# Altium schematic sheet Audio_Output_XLR2.SchDoc: Audio Out: Mini XLR 2
size 279 x 215 mm; DrawnBy: Connor Dack; Engineer: Connor Dack; DocumentNumber: 20; Revision: 1.0; SheetNumber: 20; SheetTotal: 20
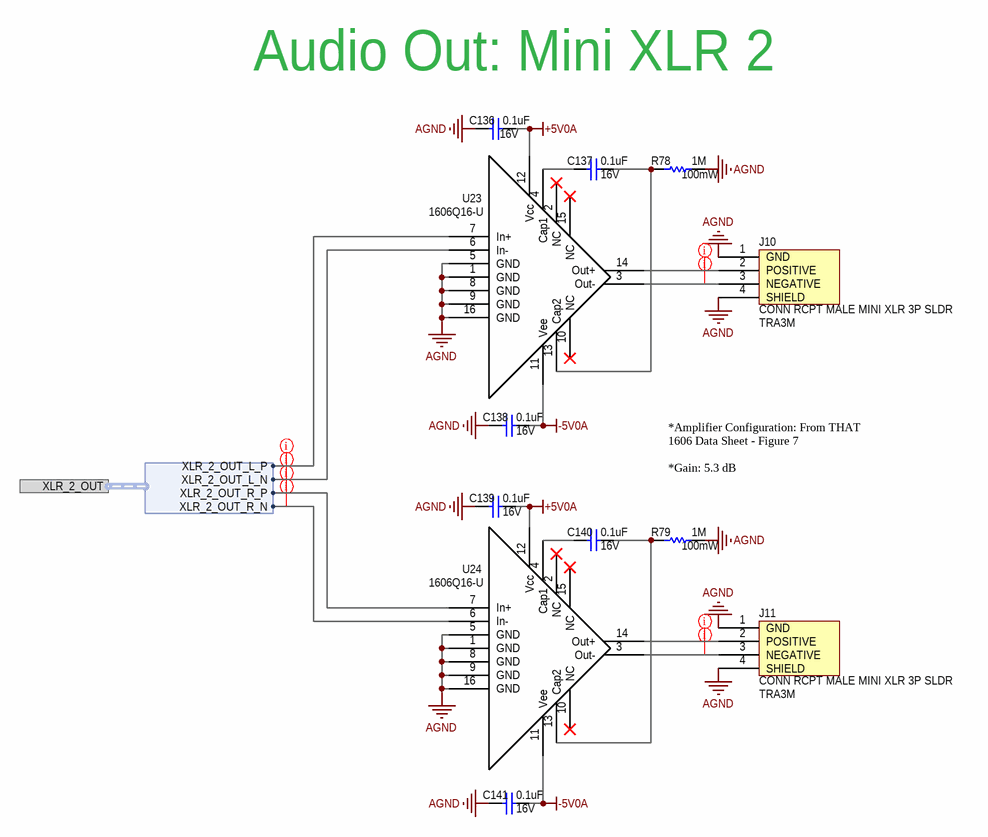
[diagram p0: Audio_Output_XLR2.SchDoc]

## Parts
C136  Voltage Rating: 16V  Capacitance: 0.1uF  [3-0603_L]  (hidden comment: CL10F104ZO8NNNC)
C137  Voltage Rating: 16V  Capacitance: 0.1uF  [3-0603_L]  (hidden comment: CL10F104ZO8NNNC)
C138  Voltage Rating: 16V  Capacitance: 0.1uF  [3-0603_L]  (hidden comment: CL10F104ZO8NNNC)
C139  Voltage Rating: 16V  Capacitance: 0.1uF  [3-0603_L]  (hidden comment: CL10F104ZO8NNNC)
C140  Voltage Rating: 16V  Capacitance: 0.1uF  [3-0603_L]  (hidden comment: CL10F104ZO8NNNC)
C141  Voltage Rating: 16V  Capacitance: 0.1uF  [3-0603_L]  (hidden comment: CL10F104ZO8NNNC)
J10  CONN RCPT MALE MINI XLR 3P SLDR  [TRA3M]
J11  CONN RCPT MALE MINI XLR 3P SLDR  [TRA3M]
R78  Max Power Dissipation: 100mW  Resistance: 1M  [3-0603_R_L]  (hidden comment: RMCF0603FG1M00)
R79  Max Power Dissipation: 100mW  Resistance: 1M  [3-0603_R_L]  (hidden comment: RMCF0603FG1M00)
U23  1606Q16-U  [SOP64P600X175-16N]
U24  1606Q16-U  [SOP64P600X175-16N]

## Ports
XLR_2_OUT (harness XLR_2_OUT)

## Harnesses
XLR_2_OUT: XLR_2_OUT_L_N, XLR_2_OUT_L_P, XLR_2_OUT_R_N, XLR_2_OUT_R_P

## Nets
+5V0A: C136.1 C139.1 U23.12(Vcc) U24.12(Vcc)
-5V0A: C138.1 C141.1 U23.11(Vee) U24.11(Vee)
AGND: C136.2 C138.2 C139.2 C141.2 J10.1(GND) J10.4(SHIELD) J11.1(GND) J11.4(SHIELD) R78.2 R79.2 U23.1(GND) U23.5(GND) U23.8(GND) U23.9(GND) U23.16(GND) U24.1(GND) U24.5(GND) U24.8(GND) U24.9(GND) U24.16(GND)
NetC137_1: C137.1 R78.1 U23.13(Cap2)
NetC137_2: C137.2 U23.4(Cap1)
NetC140_1: C140.1 R79.1 U24.13(Cap2)
NetC140_2: C140.2 U24.4(Cap1)
NetJ10_2: J10.2(POSITIVE) U23.14(Out+)
NetJ10_3: J10.3(NEGATIVE) U23.3(Out-)
NetJ11_2: J11.2(POSITIVE) U24.14(Out+)
NetJ11_3: J11.3(NEGATIVE) U24.3(Out-)
NetU23_6: U23.6(In-) ; port XLR_2_OUT.XLR_2_OUT_L_N
NetU23_7: U23.7(In+) ; port XLR_2_OUT.XLR_2_OUT_L_P
NetU24_6: U24.6(In-) ; port XLR_2_OUT.XLR_2_OUT_R_N
NetU24_7: U24.7(In+) ; port XLR_2_OUT.XLR_2_OUT_R_P

Not connected (* = marked no-connect by the designer): U23 2(NC)* 10(NC)* 15(NC)*; U24 2(NC)* 10(NC)* 15(NC)*

## Layout directives
net class XLR_2_Out: NetU23_6, NetU23_7, NetU24_6, NetU24_7
net class XLR_2_Out_Conn: NetJ10_2, NetJ10_3, NetJ11_2, NetJ11_3

## Notes on the sheet
- (near C136) Audio Out: Mini XLR 2
- *Amplifier Configuration: From THAT 1606 Data Sheet - Figure 7
  *Gain: 5.3 dB
- Title:
- Sheet:
- of
- Size:
- 11 x 8.5 Inches
- Rev:
- Date:
- Engineer:
- Time:
- File:
- Copyright 2020 Audio Logic Inc
  THE HARDWARE IS PROVIDED "AS IS", WITHOUT WARRANTY OF ANY KIND, EXPRESS OR IMPLIED, INCLUDING BUT NOT LIMITED TO THE WARRANTIES OF MERCHANTABILITY, FITNESS FOR A PARTICULAR PURPOSE AND NONINFRINGEMENT. IN NO EVENT SHALL THE AUTHORS OR COPYRIGHT HOLDERS BE LIABLE FOR ANY CLAIM, DAMAGES OR OTHER LIABILITY, WHETHER IN AN ACTION OF CONTRACT, TORT OR OTHERWISE, ARISING FROM, OUT OF OR IN CONNECTION WITH THE HARDWARE OR THE USE OR OTHER DEALINGS IN THE HARDWARE.

## Library data of the parts
C136-C141 = CL10F104ZO8NNNC: CAP CER 0.1UF 16V Y5V 0603; Manufacturer: Samsung; Tolerance: 80%; Supplier 1: Digi-Key; Stock 1: 40000; Pricing 1: 1=0.1, 10=0.038, 100=0.0169, 500=0.01208, 1000=0.00949 (USD); Mount: Surface Mount; Case/Package: 0603; Case Code (Metric): 1608; Case Code (Imperial): 0603; Min Operating Temperature: -30°C; Max Operating Temperature: 85°C; Package Quantity: 1; Packaging: Tape and Reel; Dielectric: Y5V; Length: 1.6mm; Height: 0.8mm; Width: 0.031inch; Thickness: 0.035inch; Depth: 0.8mm; Radiation Hardening: No; ComponentLink1URL: https://datasheet.ciiva.com/25805/cl10f104zo8nnnc-25805810.pdf; ComponentLink1Description: https://datasheet.ciiva.com/25805/cl10f104zo8nnnc-25805810.pdf; ComponentLink2URL: https://datasheet.ciiva.com/16199/cl10f104zo8nnnc-16199254.pdf; ComponentLink2Description: https://datasheet.ciiva.com/16199/cl10f104zo8nnnc-16199254.pdf; Supplier Part Number 1: 1276-1258-6-ND; Manufacturer Part Number: CL10F104ZO8NNNC
J10 J11 = TRA3M: 3 Position Circular Connector Receptacle, Male Pins Solder Silver; Manufacturer: Switchcraft; Body Material: Metal,Copper Alloy; Max Current Rating: 5A; Max Voltage Rating (AC): 125V; Voltage Rating: 250V; Connector Type: Receptacle,Pin; Number of Positions: 3; Number of Ports: 1; Wire/Cable Gauge: 28AWG; Supplier 1: Digi-Key; Stock 1: 295; Pricing 1: 1=12.74, 10=9.754, 25=9.5096, 50=8.7782, 100=8.2906, 250=7.9248 (USD); Mount: Through Hole,Panel,Bulkhead,PCB; Case/Package: Metal; Contact Material: Brass,Copper Alloy; Contact Plating: Nickel,Tin,Silver; Colour: Black; Number of Terminals: 3; Housing Material: Copper Alloy; Insulation Material: Thermoplastic; Min Operating Temperature: -55°C; Max Operating Temperature: 85°C; Package Quantity: 1; Current Rating: 5A; Fastening Type: Threaded; Packaging: Bulk; Gender: Male; Termination: Solder; Number of Contacts: 3; Orientation: Right Angle; Length: 15.49mm; Height: 15.24mm; Depth: 26.92mm; REACH SVHC: No SVHC; Lead Free: Lead Free; ComponentLink1URL: https://datasheet.ciiva.com/7327/tra3m-series-cd-7327368.pdf; ComponentLink1Description: https://datasheet.ciiva.com/7327/tra3m-series-cd-7327368.pdf; ComponentLink2URL: https://datasheet.ciiva.com/16879/70214235-16879259.pdf; ComponentLink2Description: https://datasheet.ciiva.com/16879/70214235-16879259.pdf; ComponentLink3URL: https://datasheet.ciiva.com/8053/28686-8053836.pdf; ComponentLink3Description: https://datasheet.ciiva.com/8053/28686-8053836.pdf; Supplier Part Number 1: SC1550-ND; Manufacturer Part Number: TRA3M
R78 R79 = RMCF0603FG1M00: RES 1M OHM 1% 1/10W 0603; Manufacturer: Stackpole Electronics; Temperature Coefficient: 100ppm/°C; Supplier 1: Digi-Key; Manufacturer Part Number: RMCF0603FG1M00; Stock 1: 129722; Pricing 1: 1=0.1, 10=0.017, 100=0.0069, 1000=0.00309, 2500=0.00268, 5000=0.00222 (USD); Mount: Surface Mount; Case/Package: 0603; Case Code (Metric): 1608; Case Code (Imperial): 0603; Contact Plating: Tin,Matte; Min Operating Temperature: -55°C; Max Operating Temperature: 155°C; Package Quantity: 1; Packaging: Tape and Reel; Tolerance: 1%; Composition: Thick Film; Number of Terminations: 2; Length: 0.061inch; Height: 0.022inch; Width: 0.031inch; Radiation Hardening: No; Lead Free: Contains Lead; ComponentLink1URL: https://www.seielect.com/Catalog/SEI-RMCF_RMCP.pdf; ComponentLink1Description: https://www.seielect.com/Catalog/SEI-RMCF_RMCP.pdf; ComponentLink2URL: https://www.seielect.com/catalog/SEI-Packaging.pdf; ComponentLink2Description: https://www.seielect.com/catalog/SEI-Packaging.pdf; Supplier Part Number 1: RMCF0603FG1M00CT-ND
U23 U24 = 1606Q16-U: Audio Amplifiers Balanced Audio Line Driver IC; Manufacturer: THAT; Max Supply Voltage: 18V; Min Supply Voltage: 4V; Nominal Supply Current: 4.9mA; Supplier 1: Mouser; Stock 1: 3475; Pricing 1: 1=4.65, 10=4.65, 50=3.91, 100=3.35, 1000=2.79, 10000=2.6 (USD); Case/Package: QSOP; Min Operating Temperature: -40°C; Max Operating Temperature: 85°C; Package Quantity: 98; Packaging: Rail/Tube; ComponentLink1URL: http://www.mouser.com/ds/2/407/1600data-6754.pdf; ComponentLink1Description: http://www.mouser.com/ds/2/407/1600data-6754.pdf; Supplier Part Number 1: 887-1606Q16-U; Manufacturer Part Number: 1606Q16-U